# EAGLE design RoboRio LED THOLE schematic (EAGLE 7.1.0)
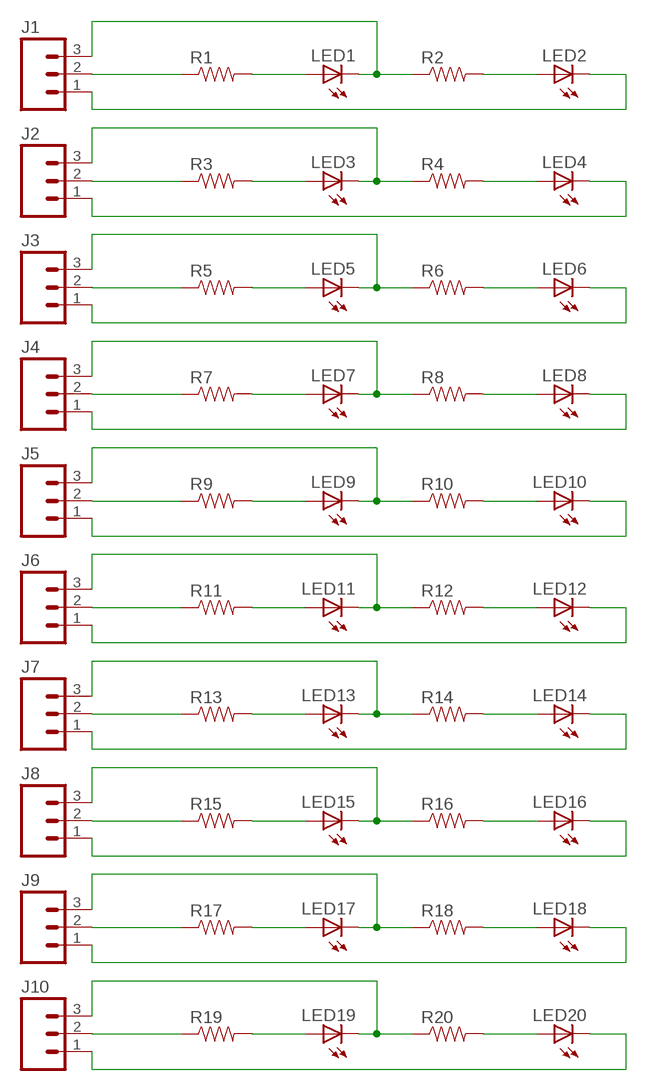
[diagram p0: schematic, sheet 1]

## Parts
J1  M03PTH  [1X03]
J2  M03PTH  [1X03]
J3  M03PTH  [1X03]
J4  M03PTH  [1X03]
J5  M03PTH  [1X03]
J6  M03PTH  [1X03]
J7  M03PTH  [1X03]
J8  M03PTH  [1X03]
J9  M03PTH  [1X03]
J10  M03PTH  [1X03]
LED1  LED3MM  [LED3MM]
LED2  LED3MM  [LED3MM]
LED3  LED3MM  [LED3MM]
LED4  LED3MM  [LED3MM]
LED5  LED3MM  [LED3MM]
LED6  LED3MM  [LED3MM]
LED7  LED3MM  [LED3MM]
LED8  LED3MM  [LED3MM]
LED9  LED3MM  [LED3MM]
LED10  LED3MM  [LED3MM]
LED11  LED3MM  [LED3MM]
LED12  LED3MM  [LED3MM]
LED13  LED3MM  [LED3MM]
LED14  LED3MM  [LED3MM]
LED15  LED3MM  [LED3MM]
LED16  LED3MM  [LED3MM]
LED17  LED3MM  [LED3MM]
LED18  LED3MM  [LED3MM]
LED19  LED3MM  [LED3MM]
LED20  LED3MM  [LED3MM]
R1  RESISTORKIT  [AXIAL-0.3-KIT]
R2  RESISTORKIT  [AXIAL-0.3-KIT]
R3  RESISTORKIT  [AXIAL-0.3-KIT]
R4  RESISTORKIT  [AXIAL-0.3-KIT]
R5  RESISTORKIT  [AXIAL-0.3-KIT]
R6  RESISTORKIT  [AXIAL-0.3-KIT]
R7  RESISTORKIT  [AXIAL-0.3-KIT]
R8  RESISTORKIT  [AXIAL-0.3-KIT]
R9  RESISTORKIT  [AXIAL-0.3-KIT]
R10  RESISTORKIT  [AXIAL-0.3-KIT]
R11  RESISTORKIT  [AXIAL-0.3-KIT]
R12  RESISTORKIT  [AXIAL-0.3-KIT]
R13  RESISTORKIT  [AXIAL-0.3-KIT]
R14  RESISTORKIT  [AXIAL-0.3-KIT]
R15  RESISTORKIT  [AXIAL-0.3-KIT]
R16  RESISTORKIT  [AXIAL-0.3-KIT]
R17  RESISTORKIT  [AXIAL-0.3-KIT]
R18  RESISTORKIT  [AXIAL-0.3-KIT]
R19  RESISTORKIT  [AXIAL-0.3-KIT]
R20  RESISTORKIT  [AXIAL-0.3-KIT]

## Nets
GND: J1.1 LED2.K(C)
GND1: J2.1 LED4.K(C)
GND2: J3.1 LED6.K(C)
GND3: J4.1 LED8.K(C)
GND4: J5.1 LED10.K(C)
GND5: J6.1 LED12.K(C)
GND6: J7.1 LED14.K(C)
GND7: J8.1 LED16.K(C)
GND8: J9.1 LED18.K(C)
GND9: J10.1 LED20.K(C)
N$1: J1.2 R1.P$1
N$2: LED1.A R1.P$2
N$3: J2.2 R3.P$1
N$4: LED2.A R2.P$2
N$5: LED4.A R4.P$2
N$6: LED3.A R3.P$2
N$7: J3.2 R5.P$1
N$8: LED6.A R6.P$2
N$9: LED5.A R5.P$2
N$10: J4.2 R7.P$1
N$11: LED8.A R8.P$2
N$12: LED7.A R7.P$2
N$13: J5.2 R9.P$1
N$14: LED10.A R10.P$2
N$15: LED9.A R9.P$2
N$16: J6.2 R11.P$1
N$17: LED12.A R12.P$2
N$18: LED11.A R11.P$2
N$19: J7.2 R13.P$1
N$20: LED14.A R14.P$2
N$21: LED13.A R13.P$2
N$22: J8.2 R15.P$1
N$23: LED16.A R16.P$2
N$24: LED15.A R15.P$2
N$25: J9.2 R17.P$1
N$26: LED18.A R18.P$2
N$27: LED17.A R17.P$2
N$28: J10.2 R19.P$1
N$29: LED20.A R20.P$2
N$30: LED19.A R19.P$2
S: J1.3 LED1.K(C) R2.P$1
S1: J2.3 LED3.K(C) R4.P$1
S2: J3.3 LED5.K(C) R6.P$1
S3: J4.3 LED7.K(C) R8.P$1
S4: J5.3 LED9.K(C) R10.P$1
S5: J6.3 LED11.K(C) R12.P$1
S6: J7.3 LED13.K(C) R14.P$1
S7: J8.3 LED15.K(C) R16.P$1
S8: J9.3 LED17.K(C) R18.P$1
S9: J10.3 LED19.K(C) R20.P$1

## Library data of the parts
J1-J10 = SparkFun-Connectors:M03: Header 3 Standard 3-pin 0.1" header. Use with straight break away headers (SKU : PRT-00116), right angle break away headers (PRT-00553), swiss pins (PRT-00743), machine pins (PRT-00117), and female headers (PRT-00115). Molex polarized connector foot print use with SKU : PRT-08232 with associated crimp pins and housings.
LED1-LED20 = led:LED: LED OSRAM: - CHIPLED LG R971, LG N971, LY N971, LG Q971, LY Q971, LO R971, LY R971 LH N974, LH R974 LS Q976, LO Q976, LY Q976 LO Q996 - Hyper CHIPLED LW Q18S LB Q993, LB Q99A, LB R99A - SideLED LS A670, LO A670, LY A670, LG A670, LP A670 LB A673, LV A673, LT A673, LW A673 LH A674 LY A675 LS A676, LA A676, LO A676, LY A676, LW A676 LS A679, LY A679, LG A679 - Hyper Micro SIDELED® LS Y876, LA Y876, LO Y876, LY Y876 LT Y87S - SmartLED LW L88C, LW L88S LB L89C, LB L89S, LG L890 LS L89K, LO L89K, LY L89K LS L896, LA L896, LO L896, LY L896 - TOPLED LS T670, LO T670, LY T670, LG T670, LP T670 LSG T670, LSP T670, LSY T670, LOP T670, LYG T670 LG T671, LOG T671, LSG T671 LB T673, LV T673, LT T673, LW T673 LH T674 LS T676, LA T676, LO T676, LY T676, LB T676, LH T676, LSB T676, LW T676 LB T67C, LV T67C, LT T67C, LS T67K, LO T67K, LY T67K, LW E67C LS E67B, LA E67B, LO E67B, LY E67B, LB E67C, LV E67C, LT E67C LW T67C LS T679, LY T679, LG T679 LS T770, LO T770, LY T770, LG T770, LP T770 LB T773, LV T773, LT T773, LW T773 LH T774 LS E675, LA E675, LY E675, LS T675 LS T776, LA T776, LO T776, LY T776, LB T776 LHGB T686 LT T68C, LB T68C - Hyper Mini TOPLED® LB M676 - Mini TOPLED Santana® LG M470 LS M47K, LO M47K, LY M47K Source: http://www.osram.convergy.de LUXEON: - LUMILED® LXK2-PW12-R00, LXK2-PW12-S00, LXK2-PW14-U00, LXK2-PW14-V00 LXK2-PM12-R00, LXK2-PM12-S00, LXK2-PM14-U00 LXK2-PE12-Q00, LXK2-PE12-R00, LXK2-PE12-S00, LXK2-PE14-T00, LXK2-PE14-U00 LXK2-PB12-K00, LXK2-PB12-L00, LXK2-PB12-M00, LXK2-PB14-N00, LXK2-PB14-P00, LXK2-PB14-Q00 LXK2-PR12-L00, LXK2-PR12-M00, LXK2-PR14-Q00, LXK2-PR14-R00 LXK2-PD12-Q00, LXK2-PD12-R00, LXK2-PD12-S00 LXK2-PH12-R00, LXK2-PH12-S00 LXK2-PL12-P00, LXK2-PL12-Q00, LXK2-PL12-R00 Source: www.luxeon.com KINGBRIGHT: KA-3528ASYC Source: www.kingbright.com
R1-R20 = SparkFun-Passives:RESISTOR: Resistor Basic schematic elements and footprints for 0603, 1206, and PTH resistors.

## Board
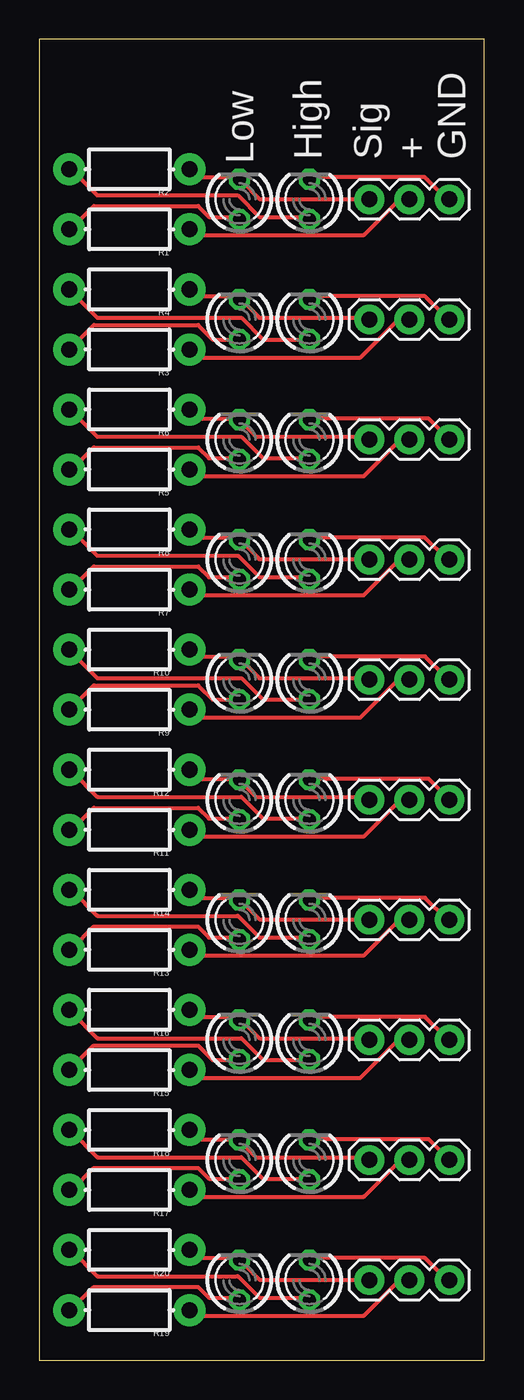
[diagram p1: board, top side]

Size 28.25 x 83.81 mm. Coordinates in mm from the lower left corner, seen from the top.
Outline: 0,0 28.25,0 28.25,83.81 0,83.81 0,0
Copper layers (1*16): Top 0.035mm / dielectric 1.5mm / Bottom 0.035mm
Design rules "default": minimum track width 10mil, minimum drill 24mil, track to track 8mil, track to pad 8mil, pad to pad 8mil, via to via 8mil, smd to smd 8mil, copper to edge 40mil, drill to drill 8mil, minimum pad ring 10mil, minimum via ring 8mil, stop-mask expansion 4mil, vias tented up to drill 0mil, thermal gap 10mil

### Footprints (pad centres in the part's own frame; a part is rotated, then mirrored left to right if it is on the bottom)
1X03 = drill 1.016 pad 1.88: 1 0,0; 2 2.54,0; 3 5.08,0
LED3MM = drill 0.813 octagon: A -1.27,0; K 1.27,0
AXIAL-0.3-KIT = drill 1.016 pad 2.032: P$1 -3.81,0; P$2 3.81,0

### Placement (x,y rotation side)
J1  26.04,73.66 180 top
J2  26.04,66.04 180 top
J3  26.04,58.42 180 top
J4  26.04,50.8 180 top
J5  26.04,43.18 180 top
J6  26.04,35.56 180 top
J7  26.04,27.94 180 top
J8  26.04,20.32 180 top
J9  26.04,12.7 180 top
J10  26.04,5.08 180 top
LED1  12.7,73.66 90 top
LED2  17.15,73.66 90 top
LED3  12.7,66.04 90 top
LED4  17.15,66.04 90 top
LED5  12.7,58.42 90 top
LED6  17.15,58.42 90 top
LED7  12.7,50.8 90 top
LED8  17.15,50.8 90 top
LED9  12.7,43.18 90 top
LED10  17.15,43.18 90 top
LED11  12.7,35.56 90 top
LED12  17.15,35.56 90 top
LED13  12.7,27.94 90 top
LED14  17.15,27.94 90 top
LED15  12.7,20.32 90 top
LED16  17.15,20.32 90 top
LED17  12.7,12.7 90 top
LED18  17.15,12.7 90 top
LED19  12.7,5.08 90 top
LED20  17.15,5.08 90 top
R1  5.72,71.75 180 top
R2  5.72,75.56 180 top
R3  5.72,64.13 180 top
R4  5.72,67.94 180 top
R5  5.72,56.52 180 top
R6  5.72,60.33 180 top
R7  5.72,48.89 180 top
R8  5.72,52.7 180 top
R9  5.72,41.27 180 top
R10  5.72,45.09 180 top
R11  5.72,33.66 180 top
R12  5.72,37.46 180 top
R13  5.72,26.04 180 top
R14  5.72,29.85 180 top
R15  5.72,18.42 180 top
R16  5.72,22.23 180 top
R17  5.72,10.79 180 top
R18  5.72,14.6 180 top
R19  5.72,3.18 180 top
R20  5.72,6.98 180 top

### Tracks (layer width: path | path; a pad name or v marks a point on that pad's centre or on a via)
GND
  Top 0.254: LED2.K 17.17,75.06 24.49,75.06 25.86,73.69 J1.1
GND1
  Top 0.254: LED4.K 17.17,67.51 24.49,67.51 25.86,66.14 J2.1
GND2
  Top 0.254: J3.1 24.71,59.74 17.17,59.74 LED6.K
GND3
  Top 0.254: LED8.K 17.17,52.2 24.49,52.2 25.86,50.82 J4.1
GND4
  Top 0.254: LED10.K 17.17,44.65 24.49,44.65 25.86,43.28 J5.1
GND5
  Top 0.254: J6.1 24.71,36.88 17.17,36.88 LED12.K
GND6
  Top 0.254: LED14.K 17.17,29.34 24.49,29.34 25.86,27.96 J7.1
GND7
  Top 0.254: LED16.K 17.17,21.79 24.49,21.79 25.86,20.42 J8.1
GND8
  Top 0.254: J9.1 24.71,14.02 17.17,14.02 LED18.K
GND9
  Top 0.254: LED20.K 17.17,6.48 24.49,6.48 25.86,5.1 J10.1
N$1
  Top 0.254: J1.2 23.34,73.46 22.66,73.46 20.6,71.4 9.86,71.4 9.63,71.63 R1.P$1
N$2
  Top 0.254: LED1.A 12.6,72.54 10.77,72.54 10.08,73.23 3.45,73.23 2.08,71.86 R1.P$2
N$3
  Top 0.254: J2.2 23.34,65.91 22.66,65.91 20.37,63.63 10.08,63.63 9.63,64.08 R3.P$1
N$4
  Top 0.254: LED2.A 16.94,72.54 13.97,72.54 12.6,73.91 3.68,73.91 2.08,75.51 R2.P$2
N$5
  Top 0.254: LED4.A 14.2,64.77 12.83,66.14 3.68,66.14 2.08,67.74 R4.P$2
N$6
  Top 0.254: LED3.A 11,64.77 10.08,65.68 3.45,65.68 R3.P$2
N$7
  Top 0.254: J3.2 23.34,58.37 22.89,58.37 20.6,56.08 9.86,56.08 9.63,56.31 R5.P$1
N$8
  Top 0.254: LED6.A 16.94,57.23 14.2,57.23 12.83,58.6 3.68,58.6 2.08,60.2 R6.P$2
N$9
  Top 0.254: LED5.A 12.6,57.23 10.77,57.23 10.08,57.91 3.45,57.91 2.08,56.54 R5.P$2
N$10
  Top 0.254: J4.2 23.34,50.6 22.66,50.6 20.6,48.54 9.86,48.54 9.63,48.77 R7.P$1
N$11
  Top 0.254: LED8.A 16.94,49.68 13.97,49.68 12.6,51.05 3.68,51.05 2.08,52.65 R8.P$2
N$12
  Top 0.254: LED7.A 12.6,49.68 10.77,49.68 10.08,50.37 3.45,50.37 2.08,49 R7.P$2
N$13
  Top 0.254: J5.2 23.34,43.05 22.66,43.05 20.37,40.77 10.08,40.77 9.63,41.22 R9.P$1
N$14
  Top 0.254: LED10.A 14.2,41.91 12.83,43.28 3.68,43.28 2.08,44.88 R10.P$2
N$15
  Top 0.254: LED9.A 11,41.91 10.08,42.82 3.45,42.82 R9.P$2
N$16
  Top 0.254: J6.2 23.34,35.51 22.89,35.51 20.6,33.22 9.86,33.22 9.63,33.45 R11.P$1
N$17
  Top 0.254: LED12.A 16.94,34.37 14.2,34.37 12.83,35.74 3.68,35.74 2.08,37.34 R12.P$2
N$18
  Top 0.254: LED11.A 12.6,34.37 10.77,34.37 10.08,35.05 3.45,35.05 2.08,33.68 R11.P$2
N$19
  Top 0.254: J7.2 23.34,27.74 22.66,27.74 20.6,25.68 9.86,25.68 9.63,25.91 R13.P$1
N$20
  Top 0.254: LED14.A 16.94,26.82 13.97,26.82 12.6,28.19 3.68,28.19 2.08,29.79 R14.P$2
N$21
  Top 0.254: LED13.A 12.6,26.82 10.77,26.82 10.08,27.51 3.45,27.51 2.08,26.14 R13.P$2
N$22
  Top 0.254: J8.2 23.34,20.19 22.66,20.19 20.37,17.91 10.08,17.91 9.63,18.36 R15.P$1
N$23
  Top 0.254: LED16.A 14.2,19.05 12.83,20.42 3.68,20.42 2.08,22.02 R16.P$2
N$24
  Top 0.254: LED15.A 11,19.05 10.08,19.96 3.45,19.96 R15.P$2
N$25
  Top 0.254: J9.2 23.34,12.65 22.89,12.65 20.6,10.36 9.86,10.36 9.63,10.59 R17.P$1
N$26
  Top 0.254: LED18.A 16.94,11.51 14.2,11.51 12.83,12.88 3.68,12.88 2.08,14.48 R18.P$2
N$27
  Top 0.254: LED17.A 12.6,11.51 10.77,11.51 10.08,12.19 3.45,12.19 2.08,10.82 R17.P$2
N$28
  Top 0.254: J10.2 23.34,4.88 22.66,4.88 20.6,2.82 9.86,2.82 9.63,3.05 R19.P$1
N$29
  Top 0.254: LED20.A 16.94,3.96 13.97,3.96 12.6,5.33 3.68,5.33 2.08,6.93 R20.P$2
N$30
  Top 0.254: LED19.A 12.6,3.96 10.77,3.96 10.08,4.65 3.45,4.65 2.08,3.28 R19.P$2
S
  Top 0.254: R2.P$1 9.63,75.51 10.08,75.06 12.6,75.06 LED1.K 12.83,74.83 13.97,73.69 20.83,73.69 J1.3
S1
  Top 0.254: R4.P$1 9.63,67.74 9.86,67.51 12.6,67.51 LED3.K 12.83,67.28 13.97,66.14 20.83,66.14 J2.3
S2
  Top 0.254: R6.P$1 9.63,60.2 10.08,59.74 12.6,59.74 LED5.K 12.83,59.51 13.74,58.6 20.83,58.6 J3.3
S3
  Top 0.254: R8.P$1 9.63,52.65 10.08,52.2 12.6,52.2 LED7.K 12.83,51.97 13.97,50.82 20.83,50.82 J4.3
S4
  Top 0.254: R10.P$1 9.63,44.88 9.86,44.65 12.6,44.65 LED9.K 12.83,44.42 13.97,43.28 20.83,43.28 J5.3
S5
  Top 0.254: R12.P$1 9.63,37.34 10.08,36.88 12.6,36.88 LED11.K 12.83,36.65 13.74,35.74 20.83,35.74 J6.3
S6
  Top 0.254: R14.P$1 9.63,29.79 10.08,29.34 12.6,29.34 LED13.K 12.83,29.11 13.97,27.96 20.83,27.96 J7.3
S7
  Top 0.254: R16.P$1 9.63,22.02 9.86,21.79 12.6,21.79 LED15.K 12.83,21.57 13.97,20.42 20.83,20.42 J8.3
S8
  Top 0.254: R18.P$1 9.63,14.48 10.08,14.02 12.6,14.02 LED17.K 12.83,13.79 13.74,12.88 20.83,12.88 J9.3
S9
  Top 0.254: R20.P$1 9.63,6.93 10.08,6.48 12.6,6.48 LED19.K 12.83,6.25 13.97,5.1 20.83,5.1 J10.3

### Text on the board
tPlace: Low | High | Sig | + | GND